# Altium schematic sheet AFE_MCU.SchDoc
size A4; SheetNumber: 2; SheetTotal: 3
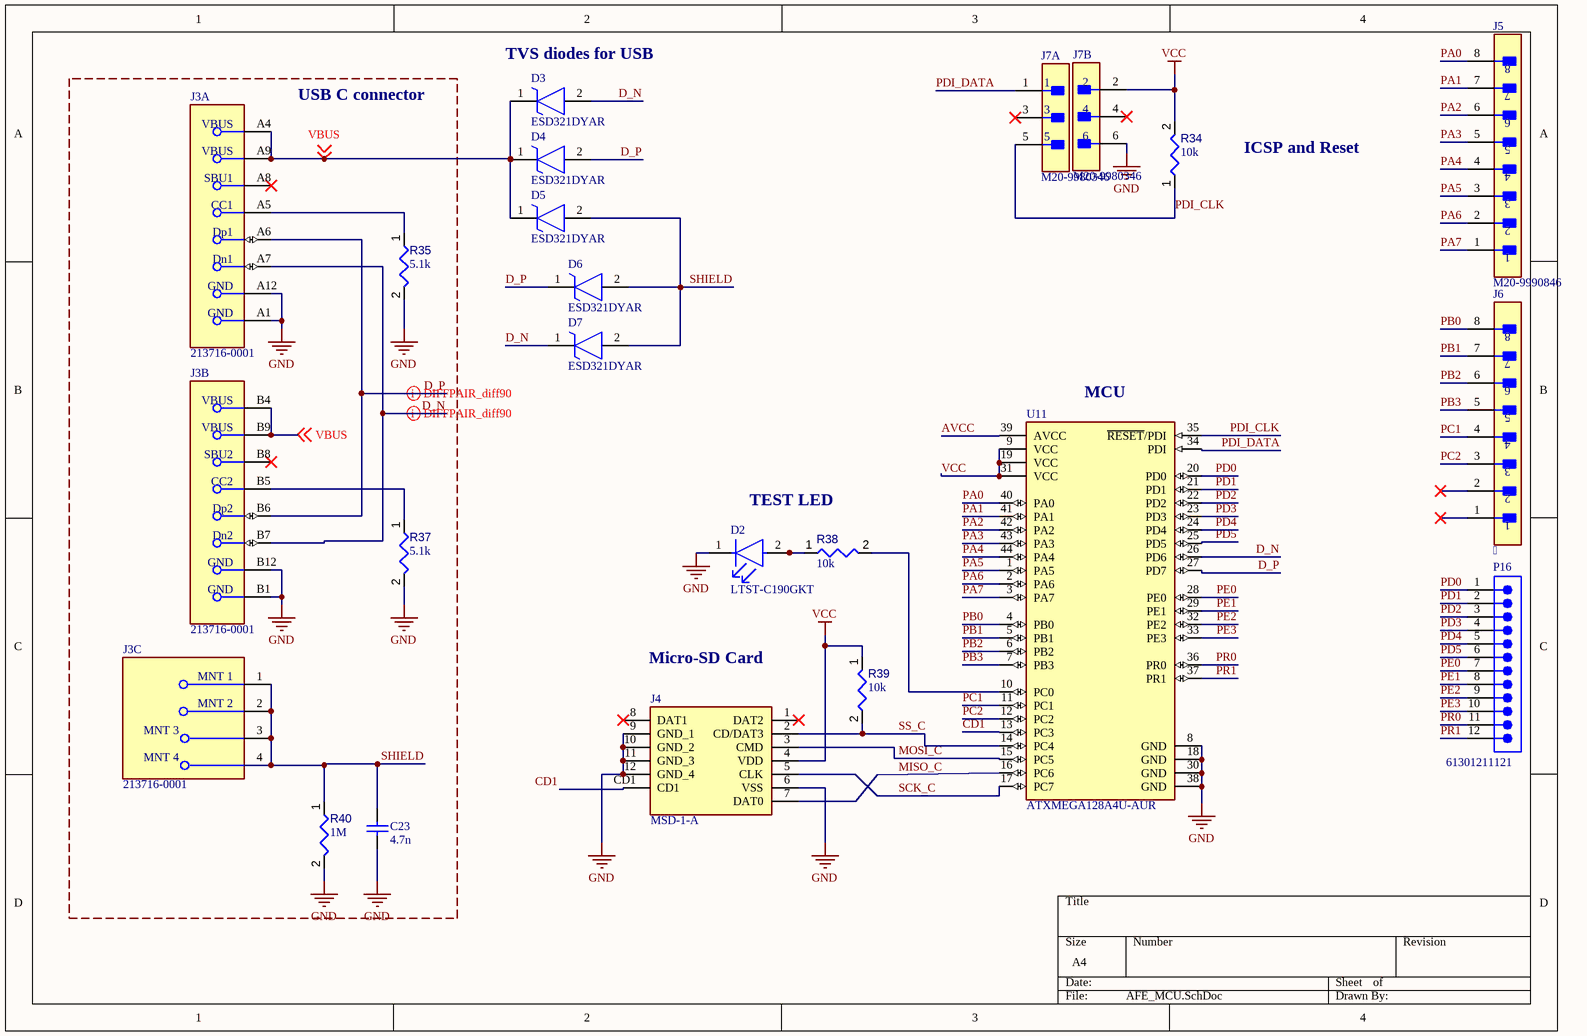
[diagram p0: AFE_MCU.SchDoc]

## Parts
C23  4.7n  [WCAP-CSGP_0402_L1W0.5H0.5]
D2  LTST-C190GKT  [FP-LTST-C190GKT-MFG]
D3  ESD321DYAR  [SODFL1608X77N]
D4  ESD321DYAR  [SODFL1608X77N]
D5  ESD321DYAR  [SODFL1608X77N]
D6  ESD321DYAR  [SODFL1608X77N]
D7  ESD321DYAR  [SODFL1608X77N]
J3  213716-0001  [FP-213716-0001-MFG]  (parts A,B,C of 3)
J4  MSD-1-A  [MSD1A]
J5  M20-9990846  [FP-M20-9990846-MFG]
J6    [FP-M20-9990846-MFG]
J7  M20-9980346  [FP-M20-9980346-MFG]  (parts A,B of 2)
P16  61301211121  [61301211121]
R34  value 10k  [RESC1005X40X25ML05T05]  (hidden comment: Resistor 4k7 +/-1% 0402 63 mW)
R35  value 5.1k  [RESC1005X40X25ML05T05]  (hidden comment: Resistor 4k7 +/-1% 0402 63 mW)
R37  value 5.1k  [RESC1005X40X25ML05T05]  (hidden comment: Resistor 4k7 +/-1% 0402 63 mW)
R38  value 10k  [RESC1005X40X25ML05T05]  (hidden comment: Resistor 4k7 +/-1% 0402 63 mW)
R39  value 10k  [RESC1005X40X25ML05T05]  (hidden comment: Resistor 4k7 +/-1% 0402 63 mW)
R40  value 1M  [RESC1005X40X25ML05T05]  (hidden comment: Resistor 4k7 +/-1% 0402 63 mW)
U11  ATXMEGA128A4U-AUR  [FP-C04-076-IPC_A]

## Blocks framed on the sheet
USB C connector: C23 J3 R35 R37 R40

## Nets
GND: C23.1 D2.1(C) J3.A1(GND) J3.A12(GND) J3.B1(GND) J3.B12(GND) J4.6(VSS) J4.9(GND_1) J4.10(GND_2) J4.11(GND_3) J4.12(GND_4) J7.6 R35.2 R37.2 R40.2 U11.8(GND) U11.18(GND) U11.30(GND) U11.38(GND)
VCC: J4.4(VDD) J7.2 R34.2 R39.1 U11.9(VCC) U11.19(VCC) U11.31(VCC)
AVCC: U11.39(AVCC)
CD1: J4.CD1 U11.13(PC3)
D_N: D3.2(A) D7.1(K) J3.A7(Dn1) J3.B7(Dn2) U11.26(PD6)
D_P: D4.2(A) D6.1(K) J3.A6(Dp1) J3.B6(Dp2) U11.27(PD7)
MISO_C: J4.7(DAT0) U11.16(PC6)
MOSI_C: J4.3(CMD) U11.15(PC5)
PA0: J5.8 U11.40(PA0)
PA1: J5.7 U11.41(PA1)
PA2: J5.6 U11.42(PA2)
PA3: J5.5 U11.43(PA3)
PA4: J5.4 U11.44(PA4)
PA5: J5.3 U11.1(PA5)
PA6: J5.2 U11.2(PA6)
PA7: J5.1 U11.3(PA7)
PB0: J6.8 U11.4(PB0)
PB1: J6.7 U11.5(PB1)
PB2: J6.6 U11.6(PB2)
PB3: J6.5 U11.7(PB3)
PC1: J6.4 U11.11(PC1)
PC2: J6.3 U11.12(PC2)
PD0: P16.1 U11.20(PD0)
PD1: P16.2 U11.21(PD1)
PD2: P16.3 U11.22(PD2)
PD3: P16.4 U11.23(PD3)
PD4: P16.5 U11.24(PD4)
PD5: P16.6 U11.25(PD5)
PDI_CLK: J7.5 R34.1 U11.35(~{RESET}/PDI)
PDI_DATA: J7.1 U11.34(PDI)
PE0: P16.7 U11.28(PE0)
PE1: P16.8 U11.29(PE1)
PE2: P16.9 U11.32(PE2)
PE3: P16.10 U11.33(PE3)
PR0: P16.11 U11.36(PR0)
PR1: P16.12 U11.37(PR1)
SCK_C: J4.5(CLK) U11.17(PC7)
SHIELD: C23.2 D5.2(A) D6.2(A) D7.2(A) J3.1(MNT_1) J3.2(MNT_2) J3.3(MNT_3) J3.4(MNT_4) R40.1
SS_C: J4.2(CD/DAT3) R39.2 U11.14(PC4)
VBUS: D3.1(K) D4.1(K) D5.1(K) J3.A4(VBUS) J3.A9(VBUS) J3.B4(VBUS) J3.B9(VBUS) ; off-sheet VBUS
NetD2_2: D2.2(A) R38.1
NetJ3_A5: J3.A5(CC1) R35.1
NetJ3_B5: J3.B5(CC2) R37.1
NetR38_2: R38.2 U11.10(PC0)

Not connected (* = marked no-connect by the designer): J3 A8(SBU1)* B8(SBU2)*; J4 1(DAT2)* 8(DAT1)*; J6 1* 2*; J7 3* 4*

## Layout directives
differential pair; differential pair class diff90: D_N, D_P

## Notes on the sheet
- (near D3) TVS diodes for USB
- ICSP and Reset
- (near U11) MCU
- TEST LED
- (near J4) Micro-SD Card

## Library data of the parts
C23 = CMP-207839-000017-2: CAP CER 10000PF 50V X7R 0402; NexarPartId: 53703204; Insulation Resistance: 10GΩ; Material: Ceramic; Tolerance: 10%; Capacitance: 10nF; Packaging: Tape & Reel (TR); Voltage Rating: 50V; Thickness: 558.8µm; Case Code (Imperial): 0402; Dielectric: X7R; Mount: Surface Mount; Width: 500µm; Height: 500µm; Min Operating Temperature: -55°C; Case/Package: 0402; RoHS: Compliant; Case Code (Metric): 1005; REACH SVHC: Unknown; Max Operating Temperature: 125°C; Voltage Rating (DC): 50V; Length: 1mm
D2 = CMP-22017-000005-2: LED GREEN CLEAR CHIP SMD; Dominant Wavelength: 569nm; Reverse Voltage: 5V; Lens Color: Colorless; Viewing Angle: 130°; Voltage: 2V; Forward Current: 30mA; Power Dissipation: 100mW; Luminous Intensity: 6mcd; Number of LEDs: 1; Forward Voltage: 2.1V; Wavelength: 565nm; Test Current: 10mA; Min Operating Temperature: -55°C; Lens Style: Clear; Mount: Surface Mount; Width: 0.8mm; Packaging: Tape and Reel; Lens Transparency: Clear; Case Code (Metric): 1608; Depth: 0.8mm; Case Code (Imperial): 0603; Case/Package: 0603; Number of Pins: 2; Max Operating Temperature: 85°C; Lead Free: Lead Free; Number of Elements: 1; Length: 1.6mm; Height: 0.8mm; Package Quantity: 1; Power Rating: 100mW; Radiation Hardening: No; Illumination Color: Green; Color: Green
D3-D7 = ESD321DYAR: TVS Diode (Uni-directional); Manufacturer_Name: Texas Instruments; Datasheet Link: https://www.ti.com/lit/ds/symlink/esd321.pdf?HQS=dis-mous-null-mousermode-dsf-pf-null-wwe&ts=1699925294630&ref_url=https%253A%252F%252Fwww.mouser.com%252F; Height: 0.77mm; Manufacturer_Part_Number: ESD321DYAR; Mouser Part Number: 595-ESD321DYAR; Mouser Price/Stock: https://www.mouser.co.uk/ProductDetail/Texas-Instruments/ESD321DYAR?qs=rQFj71Wb1eXoYwRMra0IYA%3D%3D; Arrow Part Number: ESD321DYAR; Arrow Price/Stock: https://www.arrow.com/en/products/esd321dyar/texas-instruments?utm_currency=USD&region=nac
J3 = CMP-04767-000029-1: CONN RCPT USB2.0 TYPE C 24POS RA
J4 = MSD-1-A: Connector; Manufacturer_Name: Same Sky; Datasheet Link: https://www.sameskydevices.com/product/resource/supplyframepdf/msd-1-a.pdf; Height: 2mm; Manufacturer_Part_Number: MSD-1-A; Mouser Part Number: 179-MSD-1-A; Mouser Price/Stock: https://www.mouser.co.uk/ProductDetail/Same-Sky/MSD-1-A?qs=Z%252BL2brAPG1Ip18XLC4tUPQ%3D%3D; Arrow Part Number: MSD-1-A; Arrow Price/Stock: https://www.arrow.com/en/products/msd-1-a/cui-devices?utm_currency=USD&region=nac
J5 J6 = CMP-15831-000033-1: CONN HEADER VERT 8POS 2.54MM; Connector Type: Male Pin; Gender: Male; Insulation Resistance: 1GR; Number of Positions: 8; Contact Resistance: 30mR; Current Rating: 3A; Termination: Solder; Case/Package: SIL; RoHS Compliant: Yes; Series: M20; Housing Material: Nylon; Radiation Hardening: No; Package Quantity: 1000; Contact Material: Brass; Contact Plating: Tin; Max Operating Temperature: 105°C; Contact Mating Length: 0.24inch; Depth: 2.54mm; Color: Black; Number of Contacts: 8; Mount: Through Hole; Number of Rows: 1; Packaging: Bulk; Min Operating Temperature: -40°C; Max Current Rating: 3A; REACH SVHC: No SVHC; Pitch: 2.54mm; Housing Color: Black; Orientation: Straight; Length: 20.32mm; Contact Type: Male Pin
J7 = CMP-2000-06636-2: CONN HEADER VERT 6POS 2.54MM; Manufacturer: Harwin; Current Rating: 3A; Number Of Contacts: 6; Conn Gender: Male; Conn Orientation: Vertical; Device Class L1: Connectors; ComponentLink2Description: Datasheet; Height: 8.99mm; Temperature Range High: +105°C; Contact Material: Tin,Nickel; RoHS: TRUE; Temperature Range Low: -40°C; ComponentLink2URL: https://cdn.harwin.com/pdfs/M20-998.pdf; Digikey Description: CONN HEADER VERT 6POS 2.54MM; Pitch: 2.54mm; Package: M20-9980346; Device Class L2: Headers and Wire Housings; Manufacturer Part Number: M20-9980346; Number Of Rows: 2; Category: Conn; Lead Free: Yes; Mouser Description: 2.54mm (0.1") Pitch DIL Vertical PC Tail Pin Header, 6.1mm mating pin height, tin, 3+3 contacts; Temperature: -40°C to +105°C; Device Class L3: unset; Octopart: https://octopart.com/m20-9980346-harwin-5436545; Automotive: No
P16 = CMP-1502-01086-3: NexarPartId: 32855538; Contact Resistance: 20mΩ; Current Rating: 3A; Operating Supply Voltage: 250V; Number of Positions: 12; Connector Type: Male Pin; Gender: Male; Pitch: 2.54mm; Number of Pins: 12; Mount: Through Hole; Color: Black; RoHS: Compliant; Contact Plating: Gold; Contact Material: Copper; Packaging: Bulk; Orientation: Vertical; Number of Contacts: 12; Termination: Solder; Contact Mating Length: 5.9944mm; Lead Pitch: 2.54mm; REACH SVHC: Unknown; Number of Rows: 1
R34 R35 R37-R40 = CMP-009-00034-5: Chip Resistor, 4.7 KOhm, +/- 1%, 63 mW, -55 to 155 degC, 0402 (1005 Metric); Power: 63mW; Voltage Rating: 50V; Case/Package: 0402; Tolerance: 1%; Max Operating Temperature: 155°C; Pins: 2; RoHS Compliant: True; Min Operating Temperature: -55°C; Mounting Technology: SM
U11 = CMP-06276-000232-1: IC MCU 8/16BIT 128KB FLSH 44TQFP; Oscillator Type: Internal; Core Architecture: AVR; Frequency: 32MHz; Memory Type: FLASH; Interface: I2C; Peripherals: Brown-out Detect/Reset; Number of I/Os: 34; Memory Size: 128KB; Series: AVR® XMEGA® A4U; Number of Pins: 44; Max Operating Temperature: 85°C; Min Operating Temperature: -40°C; Packaging: Tape and Reel; RoHS Compliant: Yes; Case/Package: TQFP